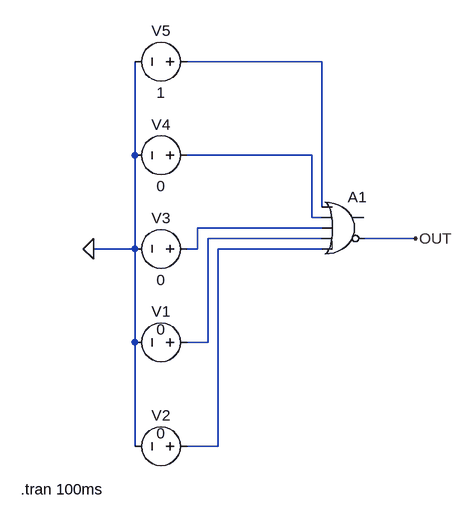
[diagram p0: schematic Draft4.asc]
Draft4.asc, the LTspice schematic file:
Version 4
SHEET 1 1184 680
WIRE 352 -352 144 -352
WIRE 64 -208 64 -352
WIRE 336 -208 144 -208
WIRE 352 -128 352 -352
WIRE 336 -112 336 -208
WIRE 352 -112 336 -112
WIRE 352 -96 160 -96
WIRE 352 -80 176 -80
WIRE 496 -80 416 -80
WIRE 64 -64 64 -208
WIRE 64 -64 0 -64
WIRE 160 -64 160 -96
WIRE 160 -64 144 -64
WIRE 352 -64 192 -64
WIRE 64 80 64 -64
WIRE 176 80 176 -80
WIRE 176 80 144 80
WIRE 64 240 64 80
WIRE 192 240 192 -64
WIRE 192 240 144 240
FLAG 496 -80 OUT
FLAG 0 -64 0
SYMBOL voltage 160 80 R90
WINDOW 0 -32 56 VBottom 2
WINDOW 3 -4 56 VBottom 2
WINDOW 123 0 0 Left 0
WINDOW 39 0 0 Left 0
SYMATTR InstName V1
SYMATTR Value 0
SYMBOL voltage 160 240 R90
WINDOW 0 -32 56 VBottom 2
WINDOW 3 -4 56 VBottom 2
WINDOW 123 0 0 Left 0
WINDOW 39 0 0 Left 0
SYMATTR InstName V2
SYMATTR Value 0
SYMBOL Digital\\or 384 -160 R0
SYMATTR InstName A1
SYMBOL voltage 160 -64 R90
WINDOW 0 -32 56 VBottom 2
WINDOW 3 32 56 VTop 2
WINDOW 123 0 0 Left 0
WINDOW 39 0 0 Left 0
SYMATTR InstName V3
SYMATTR Value 0
SYMBOL voltage 160 -208 R90
WINDOW 0 -32 56 VBottom 2
WINDOW 3 32 56 VTop 2
WINDOW 123 0 0 Left 0
WINDOW 39 0 0 Left 0
SYMATTR InstName V4
SYMATTR Value 0
SYMBOL voltage 160 -352 R90
WINDOW 0 -32 56 VBottom 2
WINDOW 3 32 56 VTop 2
WINDOW 123 0 0 Left 0
WINDOW 39 0 0 Left 0
SYMATTR InstName V5
SYMATTR Value 1
TEXT -112 306 Left 2 !.tran 100ms

The netlist it stands for:
* Draft4.asc
V1 N004 0 0
V2 N005 0 0
A1 N001 N002 N003 N004 N005 OUT 0 0 OR
V3 N003 0 0
V4 N002 0 0
V5 N001 0 1
.tran 100ms
.backanno
.end